# EAGLE design obrotomierz (EAGLE 5.10)
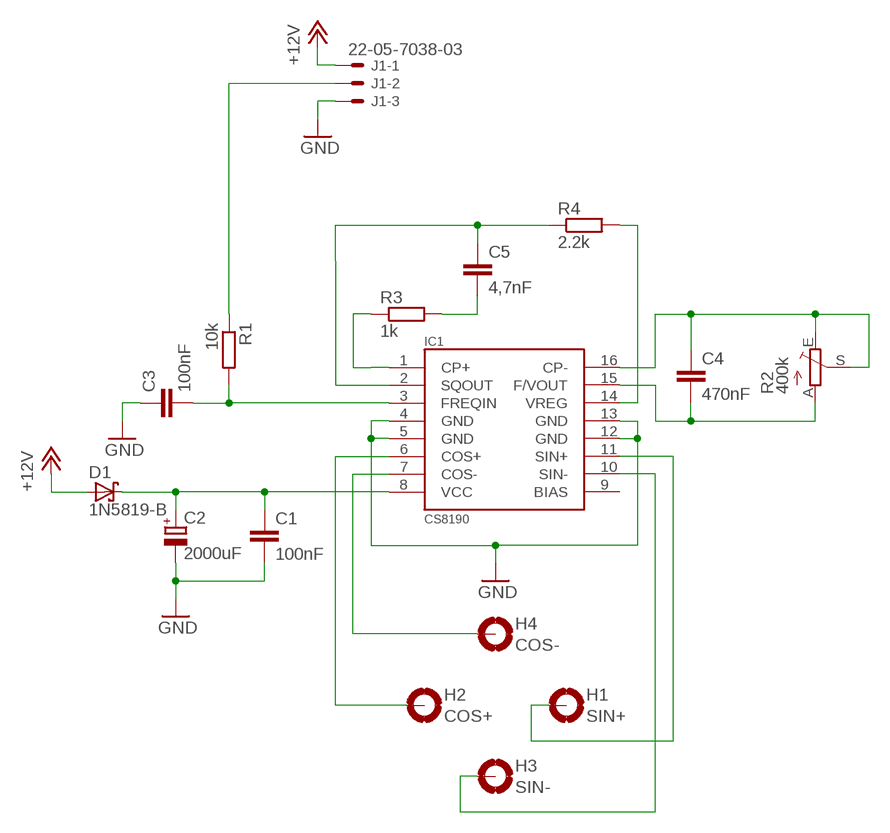
[diagram p0: schematic, sheet 1]

## Parts
C1  100nF  C-EUC0805  [C0805]
C2  2000uF  CPOL-EUE5-8.5  [E5-8,5]
C3  100nF  C-EUC0805  [C0805]
C4  470nF  C-EU050-025X075  [C050-025X075]
C5  4,7nF  C-EU050-025X075  [C050-025X075]
D1  1N5819-B  [DO41-7.6]
H1  SIN+  MOUNT-PAD-ROUND2.8  [2,8-PAD]
H2  COS+  MOUNT-PAD-ROUND2.8  [2,8-PAD]
H3  SIN-  MOUNT-PAD-ROUND2.8  [2,8-PAD]
H4  COS-  MOUNT-PAD-ROUND2.8  [2,8-PAD]
IC1  CS8190  [DIL16]
J1  22-05-7038-03  [7395-03]
R1  10k  R-EU_R0805  [R0805]
R2  400k  TRIM_EU-RJ6S  [RJ6S]
R3  1k  R-EU_R0805  [R0805]
R4  2.2k  R-EU_R0805  [R0805]

## Nets
+12V: D1.A J1.1
GND: C1.2 C2.- C3.1 IC1.4(GND) IC1.5(GND) IC1.12(GND) IC1.13(GND) J1.3
N$1: H1.B2,8(MOUNT) IC1.11(SIN+)
N$2: H3.B2,8(MOUNT) IC1.10(SIN-)
N$3: H4.B2,8(MOUNT) IC1.7(COS-)
N$4: H2.B2,8(MOUNT) IC1.6(COS+)
N$5: C3.2 IC1.3(FREQIN) R1.2
N$6: C4.2 IC1.15(F/VOUT) R2.A
N$7: C4.1 IC1.16(CP-) R2.E R2.S
N$8: C1.1 C2.+ D1.C IC1.8(VCC)
N$10: IC1.1(CP+) R3.1
N$11: C5.1 IC1.2(SQOUT) R4.1
N$13: IC1.14(VREG) R4.2
N$14: C5.2 R3.2
RPM_INPUT: J1.2 R1.1
Unconnected: IC1.9(BIAS)

## Library data of the parts
C1 C3-C5 = rcl:C-EU: CAPACITOR, European symbol
C2 = rcl:CPOL-EU: POLARIZED CAPACITOR, European symbol
D1 = diode:1N581*: 1.0A SCHOTTKY BARRIER RECTIFIER Source: http://www.diodes.com/datasheets/ds23001.pdf
H1-H4 = holes:MOUNT-PAD-ROUND: MOUNTING PAD, round
IC1 = moja:CS8190
J1 = con-molex:22-?-03: CONNECTOR wire to board 2.54 mm (.1 inch) pitch header
R1 R3 R4 = rcl:R-EU_: RESISTOR, European symbol
R2 = pot:TRIM_EU-: POTENTIOMETER

## Board
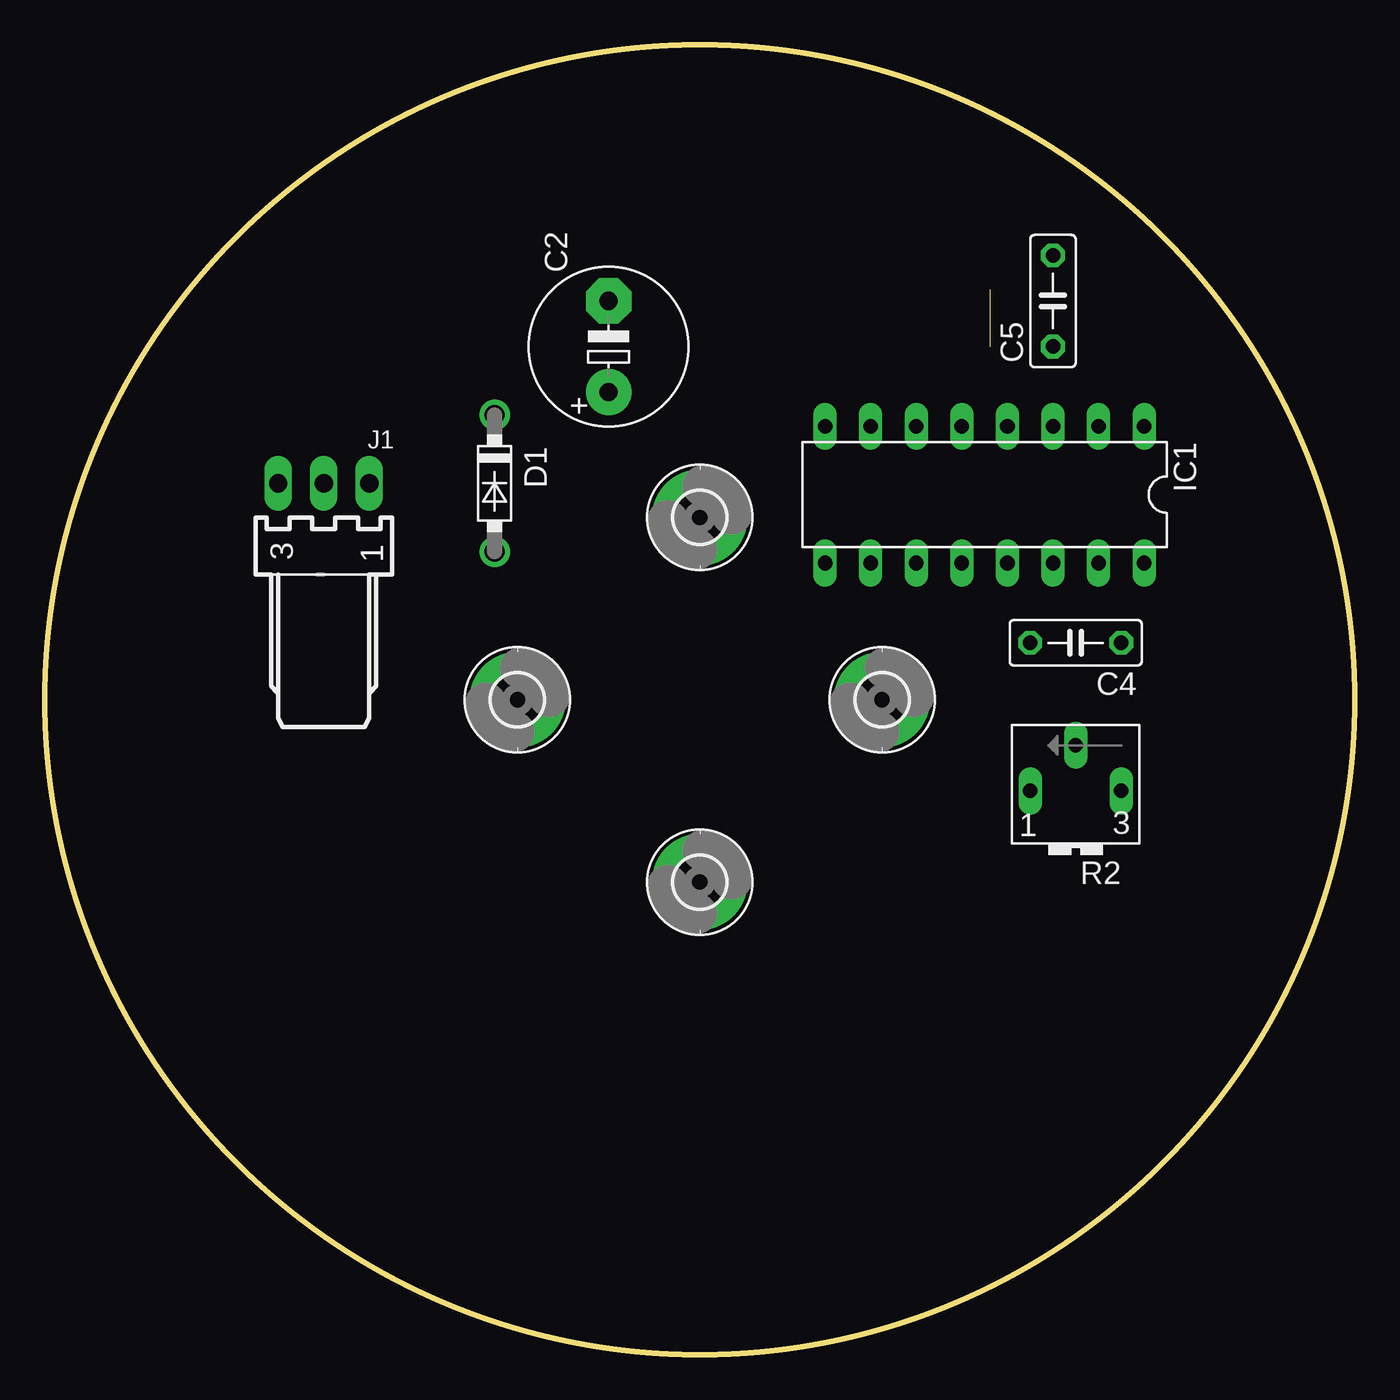
[diagram p1: board, top side]
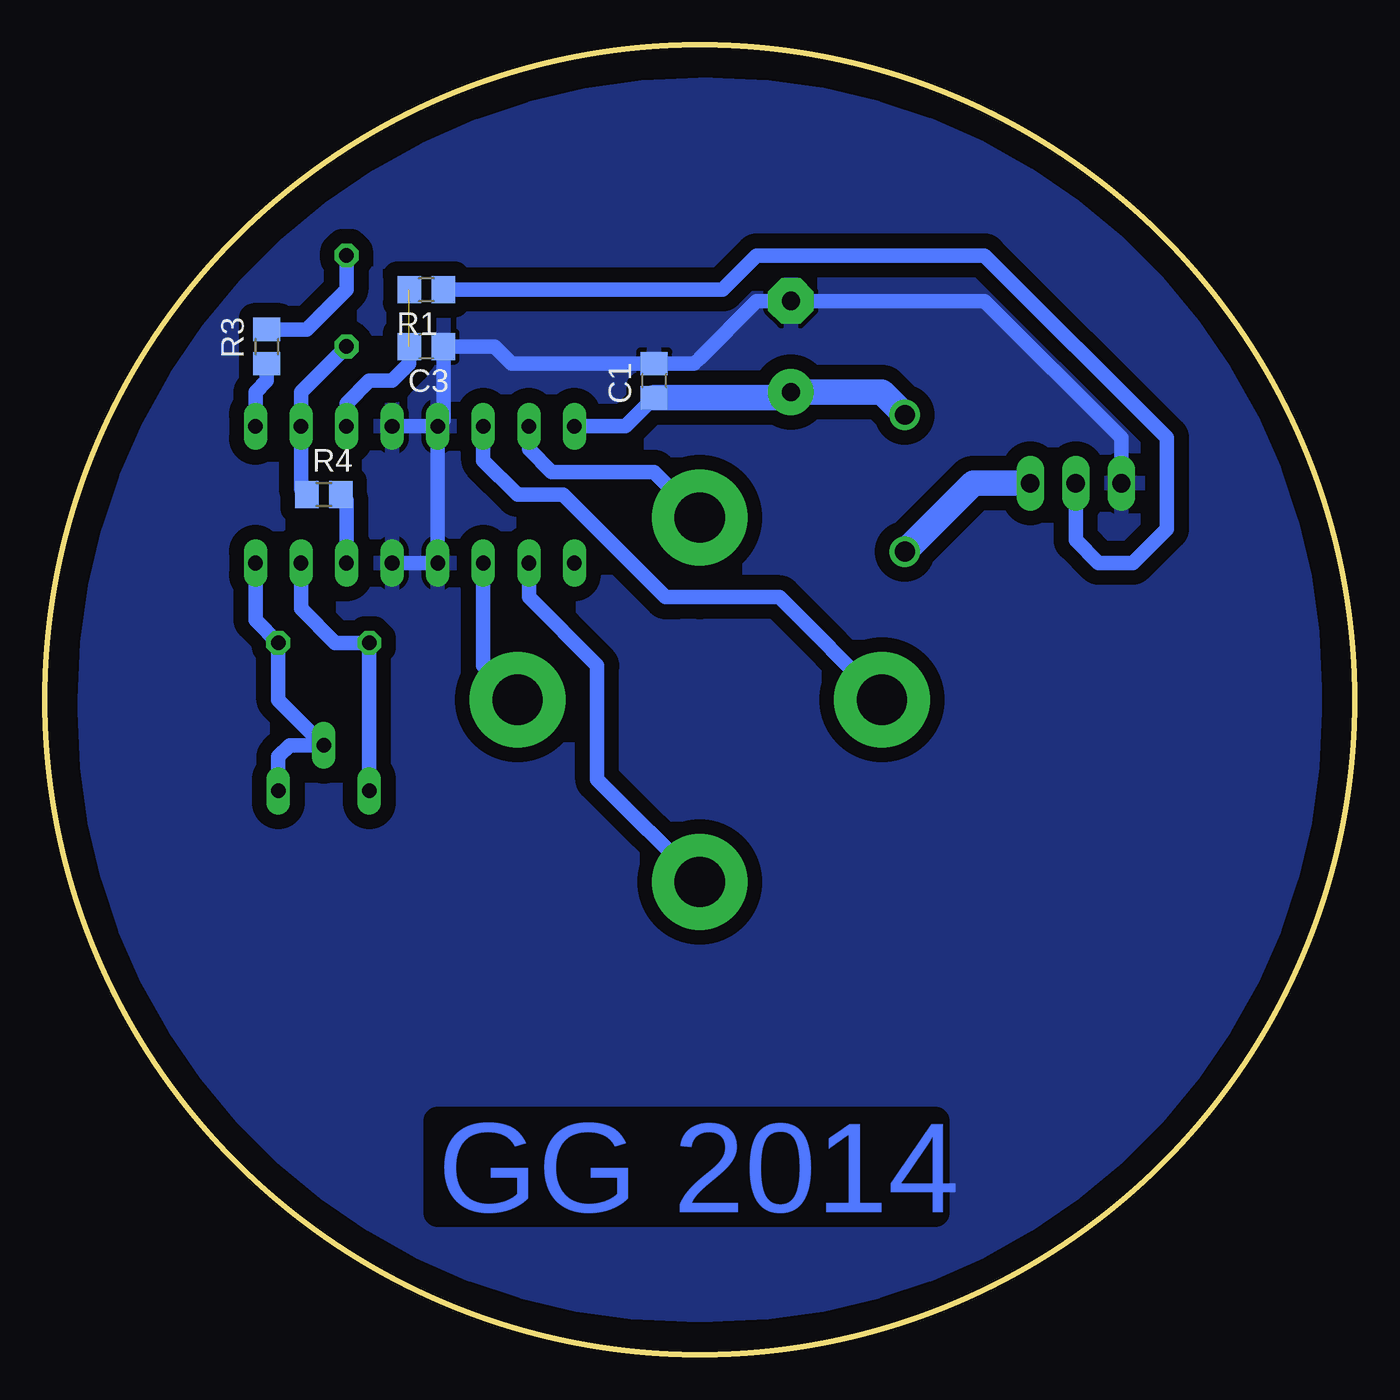
[diagram p2: board, bottom side, seen from below]

Size 73 x 73 mm. Coordinates in mm from the lower left corner, seen from the top.
Outline: circle at 36.5,36.5 radius 36.5
Copper layers (1*16): Top 0.035mm / dielectric 1.5mm / Bottom 0.035mm
Design rules "default": minimum track width 10mil, minimum drill 24mil, track to track 8mil, track to pad 8mil, pad to pad 8mil, via to via 8mil, smd to smd 8mil, copper to edge 40mil, drill to drill 8mil, minimum pad ring 10mil, minimum via ring 8mil, stop-mask expansion 4mil, vias tented up to drill 0mil, thermal gap 10mil

### Footprints (pad centres in the part's own frame; a part is rotated, then mirrored left to right if it is on the bottom)
C0805 = smd 1.3 x 1.5: 1 -0.95,0; 2 0.95,0
E5-8,5 = drill 1.016 pad 2.54 round: + -2.54,0 | drill 1.016 pad 2.54 octagon: - 2.54,0
C050-025X075 = drill 0.813 octagon: 1 -2.54,0; 2 2.54,0
DO41-7.6 = drill 1.1 pad 1.7 round: A 3.81,0; C -3.81,0
2,8-PAD = drill 2.8 pad 5.334 round: B2,8 0,0
DIL16 = drill 0.813 long: 1 -8.89,-3.81; 2 -6.35,-3.81; 3 -3.81,-3.81; 4 -1.27,-3.81; 5 1.27,-3.81; 6 3.81,-3.81; 7 6.35,-3.81; 8 8.89,-3.81; 9 8.89,3.81; 10 6.35,3.81; 11 3.81,3.81; 12 1.27,3.81; 13 -1.27,3.81; 14 -3.81,3.81; 15 -6.35,3.81; 16 -8.89,3.81
7395-03 = drill 1.016 long: 1 2.54,0; 2 0,0; 3 -2.54,0
R0805 = smd 1.3 x 1.5: 1 -0.95,0; 2 0.95,0
RJ6S = drill 0.813 long: A 2.54,0; E -2.54,0; S 0,-2.54

### Placement (x,y rotation side)
C1  39.04,54.28 90 bottom
C2  31.42,56.19 90 top
C3  51.74,56.19 180 bottom
C4  57.45,39.67 180 top
C5  56.19,58.73 90 top
D1  25.07,48.56 270 top
H1  46.66,36.5 0 top
H2  26.34,36.5 0 top
H3  36.5,26.34 0 top
H4  36.5,46.66 0 top
IC1  52.38,47.93 180 top
J1  15.55,48.56 0 top
R1  51.74,59.36 180 bottom
R2  57.45,31.42 180 top
R3  60.63,56.19 90 bottom
R4  57.45,47.93 0 bottom

### Tracks (layer width: path | path; a pad name or v marks a point on that pad's centre or on a via)
+12V
  Bottom 1.422: J1.1 21.26,48.56 D1.A
GND
  Bottom 0.813: IC1.13 IC1.12 IC1.5 | IC1.5 IC1.4 | IC1.5 50.79,52.05 C3.1 47.93,56.19 46.98,55.23 C1.2 36.82,55.23 36.5,55.55 33.33,58.73 C2.- 20.62,58.73 13,51.11 J1.3
  pour Bottom (isolate 0.813): 35.87,70.79 36.5,70.79 arc-90 70.79,36.5 70.79,35.87 arc-90 37.13,2.21 35.87,2.21 arc-90 2.21,35.87 2.21,37.13 arc-90
N$1
  Bottom 0.813: H1.B2,8 48.56,38.41 IC1.11
N$2
  Bottom 0.813: H3.B2,8 42.22,32.05 42.22,38.41 46.02,42.22 IC1.10
N$3
  Bottom 0.813: H4.B2,8 39.04,49.2 44.12,49.2 44.76,49.2 46.02,50.47 IC1.7
N$4
  Bottom 0.813: H2.B2,8 32.05,42.22 36.5,42.22 37.77,42.22 38.41,42.22 44.12,47.93 45.39,47.93 46.66,47.93 48.56,49.84 IC1.6
N$5  (1 unrouted)
  Bottom 0.813: IC1.3 56.19,53.01 54.91,54.28 53.64,54.28 52.69,55.23 C3.2
N$6
  Bottom 0.813: IC1.15 58.73,41.58 56.82,39.67 C4.2 R2.A
N$7
  Bottom 0.813: IC1.16 61.27,40.95 C4.1 60,36.5 R2.S 59.36,33.96 60,33.33 R2.E
N$8
  Bottom 0.813: C1.1 40.63,51.74 IC1.8 | C2.+ 31.73,53.33
  Bottom 1.422: 31.73,53.33 C1.1 | D1.C 26.34,53.64 C2.+
N$10
  Bottom 0.813: IC1.1 61.27,53.64 60.63,54.28 R3.1
N$11
  Bottom 0.813: C5.1 58.73,53.64 IC1.2 58.73,48.25 R4.1
N$13
  Bottom 0.813: IC1.14 56.19,47.61 R4.2
N$14
  Bottom 0.813: R3.2 58.41,57.14 56.19,59.36 C5.2
RPM_INPUT
  Bottom 0.813: J1.2 15.55,45.39 14.27,44.12 12.37,44.12 10.46,46.02 10.46,51.11 20.62,61.27 33.33,61.27 35.23,59.36 R1.1

### Text on the board
Bottom: GG 2014